# Altium schematic sheet BANK_0.SchDoc
size A4
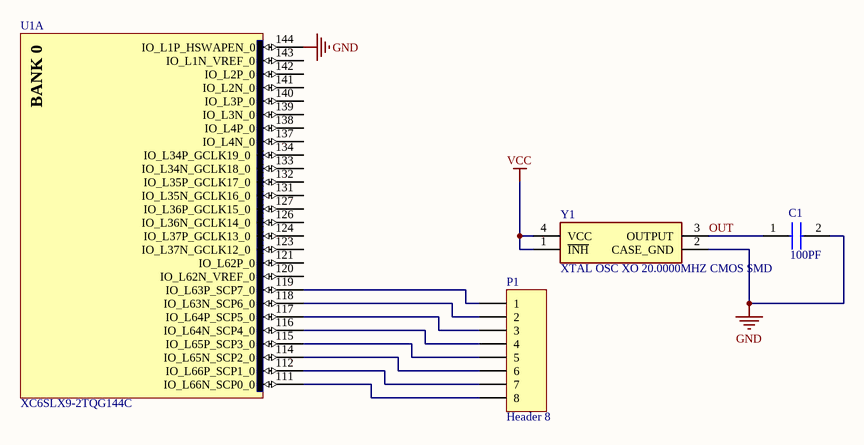
[diagram p0: BANK_0.SchDoc]

## Parts
C1  100PF  [CAPC2012X90N]
P1  Header 8  [HDR1X8]
U1  XC6SLX9-2TQG144C  [TQG144_N]  (part A of 7)
Y1  XTAL OSC XO 20.0000MHZ CMOS SMD  [KC5032A12.0000CM0E00]

## Nets
GND: C1.2 U1.144(IO_L1P_HSWAPEN_0) Y1.2(CASE_GND)
VCC: Y1.1(~{INH}) Y1.4(VCC)
OUT: C1.1 Y1.3(OUTPUT)
NetP1_1: P1.1 U1.119(IO_L63P_SCP7_0)
NetP1_2: P1.2 U1.118(IO_L63N_SCP6_0)
NetP1_3: P1.3 U1.117(IO_L64P_SCP5_0)
NetP1_4: P1.4 U1.116(IO_L64N_SCP4_0)
NetP1_5: P1.5 U1.115(IO_L65P_SCP3_0)
NetP1_6: P1.6 U1.114(IO_L65N_SCP2_0)
NetP1_7: P1.7 U1.112(IO_L66P_SCP1_0)
NetP1_8: P1.8 U1.111(IO_L66N_SCP0_0)

Not connected (* = marked no-connect by the designer): U1 120(IO_L62N_VREF_0) 121(IO_L62P_0) 123(IO_L37N_GCLK12_0) 124(IO_L37P_GCLK13_0) 126(IO_L36N_GCLK14_0) 127(IO_L36P_GCLK15_0) 131(IO_L35N_GCLK16_0) 132(IO_L35P_GCLK17_0) 133(IO_L34N_GCLK18_0) 134(IO_L34P_GCLK19_0) 137(IO_L4N_0) 138(IO_L4P_0) 139(IO_L3N_0) 140(IO_L3P_0) 141(IO_L2N_0) 142(IO_L2P_0) 143(IO_L1N_VREF_0)

## Notes on the sheet
- (in symbol XC6SLX9-2TQG144C, part A) BANK 0

## Library data of the parts
C1 = CAP CER 0.1UF 16V X7R 0805: Capacitor; Manufacturer_Name: Wurth Elektronik; Manufacturer_Part_Number: 885012207045; Datasheet Link: https://katalog.we-online.com/pbs/datasheet/885012207045.pdf; Height: 0.9mm; Mouser Part Number: 710-885012207045; Mouser Price/Stock: https://www.mouser.com/Search/Refine.aspx?Keyword=710-885012207045; RS Part Number: 1814041P; RS Price/Stock: http://uk.rs-online.com/web/p/products/1814041P
P1 = Header 8: Header, 8-Pin; LatestRevisionDate: 17-Jul-2002; LatestRevisionNote: Re-released for DXP Platform.; Publisher: Altium Limited
U1 = XC6SLX9-2TQG144C: Spartan-6 LX 1.2V FPGA, 102 User I/Os, 144-Pin TQFP (0.5mm Pitch), Speed Grade 2, Commercial Grade, Pb-Free; DatasheetVersion: ver1.6, Nov-2010; PackageVersion: ver1.2, Jun-2004; PackageReference: TQG144; PackageDescription: 144-Pin Thin Quad Flat Pack (TQG144) - Pb-Free; Code_JEDEC: MS-026-BFB; ComponentLink1Description: Manufacturer URL; ComponentLink1URL: http://www.xilinx.com/; ComponentLink2Description: Spartan-6 Datasheet; ComponentLink2URL: http://www.xilinx.com/support/documentation/data_sheets/ds160.pdf; ComponentLink3Description: Spartan-6 Documents; ComponentLink3URL: http://www.xilinx.com/support/documentation/spartan-6.htm
Y1 = XTAL OSC XO 20.0000MHZ CMOS SMD: Crystal or Oscillator; Manufacturer_Name: KYOCERA; Manufacturer_Part_Number: KC5032A20.0000CMGE00; Datasheet Link: http://global.kyocera.com/prdct/electro/product/pdf/kc5032a_cm_e.pdf; Mouser Part Number: 581-KC5032A20.CMGE